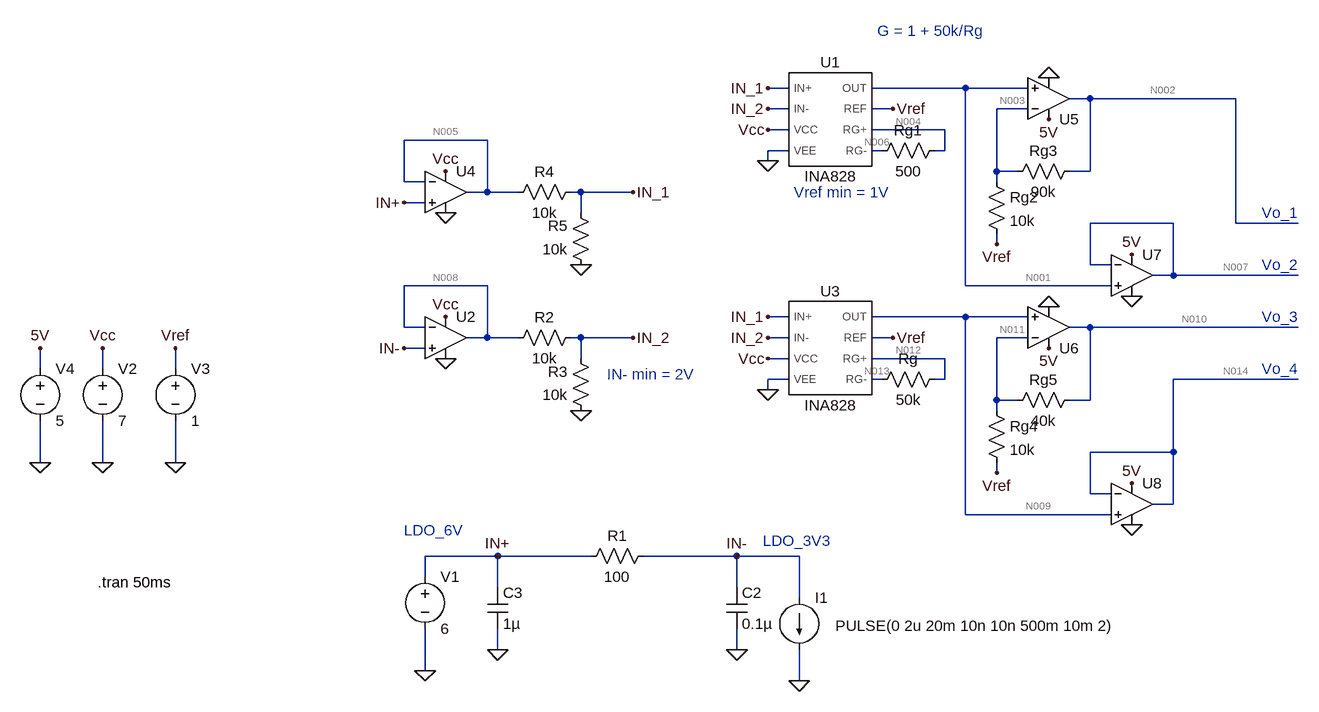
[diagram p0: schematic amplifier_v2.asc]
amplifier_v2.asc, the LTspice schematic file:
Version 4
SHEET 1 1268 680
WIRE -96 -704 -128 -704
WIRE 176 -704 32 -704
WIRE 272 -704 176 -704
WIRE 368 -688 336 -688
WIRE 592 -688 368 -688
WIRE -96 -672 -128 -672
WIRE 64 -672 32 -672
WIRE 272 -672 224 -672
WIRE -96 -640 -128 -640
WIRE 144 -640 32 -640
WIRE -560 -624 -688 -624
WIRE -96 -608 -128 -608
WIRE 48 -608 32 -608
WIRE 144 -608 144 -640
WIRE 144 -608 128 -608
WIRE -128 -592 -128 -608
WIRE 224 -576 224 -672
WIRE 256 -576 224 -576
WIRE 368 -576 368 -688
WIRE 368 -576 336 -576
WIRE -688 -560 -688 -624
WIRE -656 -560 -688 -560
WIRE 224 -560 224 -576
WIRE -560 -544 -560 -624
WIRE -560 -544 -592 -544
WIRE -512 -544 -560 -544
WIRE -416 -544 -432 -544
WIRE -336 -544 -416 -544
WIRE -656 -528 -688 -528
WIRE -416 -512 -416 -544
WIRE 496 -496 368 -496
WIRE 592 -496 592 -688
WIRE 688 -496 592 -496
WIRE 224 -464 224 -480
WIRE 368 -432 368 -496
WIRE 400 -432 368 -432
WIRE 496 -416 496 -496
WIRE 496 -416 464 -416
WIRE 688 -416 496 -416
WIRE -560 -400 -688 -400
WIRE 176 -400 176 -704
WIRE 400 -400 176 -400
WIRE -96 -352 -128 -352
WIRE 176 -352 32 -352
WIRE 272 -352 176 -352
WIRE -688 -336 -688 -400
WIRE -656 -336 -688 -336
WIRE 368 -336 336 -336
WIRE 688 -336 368 -336
WIRE -560 -320 -560 -400
WIRE -560 -320 -592 -320
WIRE -512 -320 -560 -320
WIRE -416 -320 -432 -320
WIRE -336 -320 -416 -320
WIRE -96 -320 -128 -320
WIRE 64 -320 32 -320
WIRE 272 -320 224 -320
WIRE -656 -304 -688 -304
WIRE -416 -288 -416 -320
WIRE -96 -288 -128 -288
WIRE 144 -288 32 -288
WIRE -1248 -272 -1248 -304
WIRE -1152 -272 -1152 -304
WIRE -1040 -272 -1040 -304
WIRE -96 -256 -128 -256
WIRE 48 -256 32 -256
WIRE 144 -256 144 -288
WIRE 144 -256 128 -256
WIRE 688 -256 496 -256
WIRE -128 -240 -128 -256
WIRE 224 -224 224 -320
WIRE 256 -224 224 -224
WIRE 368 -224 368 -336
WIRE 368 -224 336 -224
WIRE 224 -208 224 -224
WIRE 496 -144 496 -256
WIRE 496 -144 368 -144
WIRE -1248 -128 -1248 -192
WIRE -1152 -128 -1152 -192
WIRE -1040 -128 -1040 -192
WIRE 224 -112 224 -128
WIRE 368 -80 368 -144
WIRE 400 -80 368 -80
WIRE 496 -64 496 -144
WIRE 496 -64 464 -64
WIRE 176 -48 176 -352
WIRE 400 -48 176 -48
WIRE -544 16 -656 16
WIRE -400 16 -544 16
WIRE -176 16 -320 16
WIRE -80 16 -176 16
WIRE -656 48 -656 16
WIRE -544 64 -544 16
WIRE -176 64 -176 16
WIRE -80 80 -80 16
WIRE -544 160 -544 128
WIRE -176 160 -176 128
WIRE -656 192 -656 128
WIRE -80 208 -80 160
FLAG -656 192 0
FLAG -80 208 0
FLAG -176 160 0
FLAG -544 160 0
FLAG -544 16 IN+
FLAG -176 16 IN-
FLAG -1152 -128 0
FLAG -1040 -128 0
FLAG -1040 -304 Vref
FLAG -1152 -304 Vcc
FLAG -624 -288 0
FLAG -624 -352 Vcc
FLAG -624 -576 Vcc
FLAG -688 -528 IN+
FLAG -688 -304 IN-
FLAG -336 -544 IN_1
FLAG -336 -320 IN_2
FLAG -1248 -128 0
FLAG -1248 -304 5V
FLAG -624 -512 0
FLAG -416 -432 0
FLAG -416 -208 0
FLAG -128 -592 0
FLAG -128 -704 IN_1
FLAG -128 -672 IN_2
FLAG 64 -672 Vref
FLAG -128 -240 0
FLAG -128 -352 IN_1
FLAG -128 -320 IN_2
FLAG 64 -320 Vref
FLAG 304 -720 0
FLAG 224 -464 Vref
FLAG 304 -368 0
FLAG 224 -112 Vref
FLAG -128 -288 Vcc
FLAG -128 -640 Vcc
FLAG 304 -656 5V
FLAG 304 -304 5V
FLAG 432 -384 0
FLAG 432 -32 0
FLAG 432 -448 5V
FLAG 432 -96 5V
SYMBOL voltage -656 32 R0
WINDOW 123 0 0 Left 0
WINDOW 39 0 0 Left 0
SYMATTR InstName V1
SYMATTR Value 6
SYMBOL res -304 0 R90
WINDOW 0 0 56 VBottom 2
WINDOW 3 32 56 VTop 2
SYMATTR InstName R1
SYMATTR Value 100
SYMBOL cap -192 64 R0
SYMATTR InstName C2
SYMATTR Value 0.1µ
SYMBOL current -80 80 R0
WINDOW 123 0 0 Left 0
WINDOW 39 0 0 Left 0
WINDOW 3 56 43 Left 2
SYMATTR Value PULSE(0 2u 20m 10n 10n 500m 10m 2)
SYMATTR InstName I1
SYMBOL cap -560 64 R0
SYMATTR InstName C3
SYMATTR Value 1µ
SYMBOL voltage -1152 -288 R0
WINDOW 123 0 0 Left 0
WINDOW 39 0 0 Left 0
SYMATTR InstName V2
SYMATTR Value 7
SYMBOL voltage -1040 -288 R0
WINDOW 123 0 0 Left 0
WINDOW 39 0 0 Left 0
SYMATTR InstName V3
SYMATTR Value 1
SYMBOL res -416 -336 R90
WINDOW 0 0 56 VBottom 2
WINDOW 3 32 56 VTop 2
SYMATTR InstName R2
SYMATTR Value 10k
SYMBOL res -400 -192 R180
WINDOW 0 36 76 Left 2
WINDOW 3 36 40 Left 2
SYMATTR InstName R3
SYMATTR Value 10k
SYMBOL OpAmps\\UniversalOpamp -624 -320 R0
SYMATTR InstName U2
SYMBOL res -416 -560 R90
WINDOW 0 0 56 VBottom 2
WINDOW 3 32 56 VTop 2
SYMATTR InstName R4
SYMATTR Value 10k
SYMBOL res -400 -416 R180
WINDOW 0 36 76 Left 2
WINDOW 3 36 40 Left 2
SYMATTR InstName R5
SYMATTR Value 10k
SYMBOL OpAmps\\UniversalOpamp -624 -544 R0
SYMATTR InstName U4
SYMBOL voltage -1248 -288 R0
WINDOW 123 0 0 Left 0
WINDOW 39 0 0 Left 0
SYMATTR InstName V4
SYMATTR Value 5
SYMBOL res 32 -240 R270
WINDOW 0 32 56 VTop 2
WINDOW 3 0 56 VBottom 2
SYMATTR InstName Rg
SYMATTR Value 50k
SYMBOL INA828 -32 -656 R0
SYMATTR InstName U1
SYMBOL res 32 -592 R270
WINDOW 0 32 56 VTop 2
WINDOW 3 0 56 VBottom 2
SYMATTR InstName Rg1
SYMATTR Value 500
SYMBOL INA828 -32 -304 R0
SYMATTR InstName U3
SYMBOL OpAmps\\UniversalOpamp 304 -688 M180
SYMATTR InstName U5
SYMBOL res 208 -576 R0
SYMATTR InstName Rg2
SYMATTR Value 10k
SYMBOL res 352 -592 R90
WINDOW 0 0 56 VBottom 2
WINDOW 3 32 56 VTop 2
SYMATTR InstName Rg3
SYMATTR Value 90k
SYMBOL OpAmps\\UniversalOpamp 304 -336 M180
SYMATTR InstName U6
SYMBOL res 208 -224 R0
SYMATTR InstName Rg4
SYMATTR Value 10k
SYMBOL res 352 -240 R90
WINDOW 0 0 56 VBottom 2
WINDOW 3 32 56 VTop 2
SYMATTR InstName Rg5
SYMATTR Value 40k
SYMBOL OpAmps\\UniversalOpamp 432 -416 R0
SYMATTR InstName U7
SYMBOL OpAmps\\UniversalOpamp 432 -64 R0
SYMATTR InstName U8
TEXT -1160 56 Left 2 !.tran 50ms
TEXT 40 -792 Left 2 ;G = 1 + 50k/Rg
TEXT -376 -264 Left 2 ;IN- min = 2V
TEXT 632 -352 Left 2 ;Vo_3
TEXT 632 -432 Left 2 ;Vo_2
TEXT 632 -512 Left 2 ;Vo_1
TEXT 632 -272 Left 2 ;Vo_4
TEXT -88 -544 Left 2 ;Vref min = 1V
TEXT -688 -24 Left 2 ;LDO_6V
TEXT -136 -8 Left 2 ;LDO_3V3

The netlist it stands for:
* amplifier_v2.asc
V1 IN+ 0 6
R1 IN- IN+ 100
C2 IN- 0 0.1µ
I1 IN- 0 PULSE(0 2u 20m 10n 10n 500m 10m 2)
C3 IN+ 0 1µ
V2 Vcc 0 7
V3 Vref 0 1
R2 IN_2 N008 10k
R3 0 IN_2 10k
XU2 IN- N008 Vcc 0 N008 level1 Avol=1Meg GBW=10Meg Vos=0 En=0 Enk=0 In=0 Ink=0 Rin=500Meg  ; pins In+ In- V+ V- OUT
R4 IN_1 N005 10k
R5 0 IN_1 10k
XU4 IN+ N005 Vcc 0 N005 level1 Avol=1Meg GBW=10Meg Vos=0 En=0 Enk=0 In=0 Ink=0 Rin=500Meg  ; pins In+ In- V+ V- OUT
V4 5V 0 5
Rg N013 N012 50k
XU1 IN_1 IN_2 Vcc 0 N001 Vref N004 N006 INA828  ; pins IN+ IN- VCC VEE OUT REF RG+ RG-
Rg1 N006 N004 500
XU3 IN_1 IN_2 Vcc 0 N009 Vref N012 N013 INA828  ; pins IN+ IN- VCC VEE OUT REF RG+ RG-
XU5 N001 N003 5V 0 N002 level1 Avol=1Meg GBW=10Meg Vos=0 En=0 Enk=0 In=0 Ink=0 Rin=500Meg  ; pins In+ In- V+ V- OUT
Rg2 N003 Vref 10k
Rg3 N002 N003 90k
XU6 N009 N011 5V 0 N010 level1 Avol=1Meg GBW=10Meg Vos=0 En=0 Enk=0 In=0 Ink=0 Rin=500Meg  ; pins In+ In- V+ V- OUT
Rg4 N011 Vref 10k
Rg5 N010 N011 40k
XU7 N001 N007 5V 0 N007 level1 Avol=1Meg GBW=10Meg Vos=0 En=0 Enk=0 In=0 Ink=0 Rin=500Meg  ; pins In+ In- V+ V- OUT
XU8 N009 N014 5V 0 N014 level1 Avol=1Meg GBW=10Meg Vos=0 En=0 Enk=0 In=0 Ink=0 Rin=500Meg  ; pins In+ In- V+ V- OUT
.tran 50ms
* G = 1 + 50k/Rg
* IN- min = 2V
* Vo_3
* Vo_2
* Vo_1
* Vo_4
* Vref min = 1V
* LDO_6V
* LDO_3V3
.lib UniversalOpAmp1.lib
.lib D:\Users\javi_\GitHub\Microwatt_Board\Simu_Microwatt_Board\INA828.LIB
.backanno
.end

* Results of the author's LTspice run, read from the files saved beside the schematic
* Operating Point, zero values left out:
*   V(in+) = 6 V
*   V(in-) = 6 V
*   V(vcc) = 7 V
*   V(vref) = 1 V
*   V(in_2) = 3 V
*   V(n008) = 6 V
*   V(in_1) = 3 V
*   V(n005) = 6 V
*   V(5v) = 5 V
*   V(n013) = 2.982 V
*   V(n012) = 2.982 V
*   V(n006) = 2.982 V
*   V(n004) = 2.982 V
*   V(n001) = 1.019 V
*   V(n009) = 1.018 V
*   V(n003) = 1.019 V
*   V(n002) = 1.19 V
*   V(n011) = 1.018 V
*   V(n010) = 1.09 V
*   V(n007) = 1.019 V
*   V(n014) = 1.018 V
*   I(Rg5) = 1.808 µA
*   I(Rg4) = 1.811 µA
*   I(Rg3) = 1.901 µA
*   I(Rg2) = 1.904 µA
*   I(Rg1) = -37.5 nA
*   I(Rg) = -375 pA
*   I(R5) = -300 µA
*   I(R4) = -300 µA
*   I(R3) = -300 µA
*   I(R2) = -300 µA
*   I(R1) = -5 nA
*   I(V4) = -10 µA
*   I(V3) = 53.28 µA
*   I(V2) = -1.306 mA
*   I(V1) = -10 nA
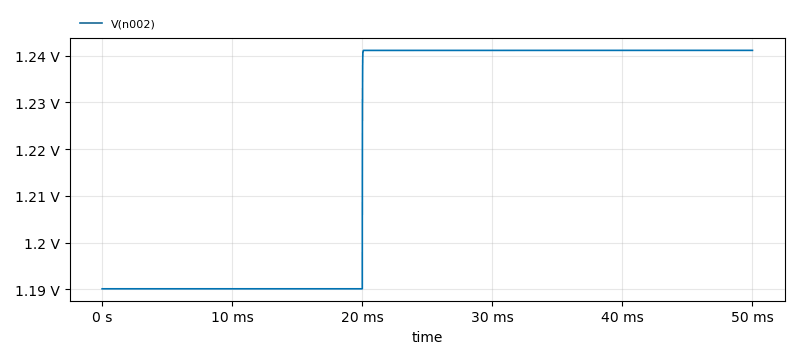
[diagram p1: Transient Analysis of amplifier_v2.asc, plotted from the saved traces]
* Transient Analysis, 1 run:
*   V(n002): min 1.19 V, max 1.241 V, average 1.221 V, rms 1.221 V, last 1.241 V